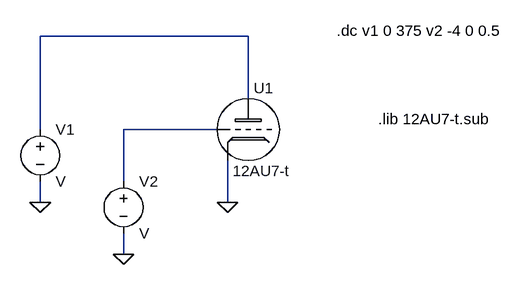
[diagram p0: schematic 12AU7.asc]
12AU7.asc, the LTspice schematic file:
Version 4
SHEET 1 880 680
WIRE 336 144 16 144
WIRE 336 240 336 144
WIRE 16 288 16 144
WIRE 288 288 144 288
WIRE 144 368 144 288
WIRE 16 400 16 368
WIRE 304 400 304 336
WIRE 144 480 144 448
FLAG 16 400 0
FLAG 144 480 0
FLAG 304 400 0
SYMBOL 12AU7-t 336 288 R0
SYMATTR InstName U1
SYMBOL voltage 16 272 R0
SYMATTR InstName V1
SYMBOL voltage 144 352 R0
SYMATTR InstName V2
TEXT 472 136 Left 2 !.dc v1 0 375 v2 -4 0 0.5
TEXT 536 272 Left 2 !.lib 12AU7-t.sub

The netlist it stands for:
* 12AU7.asc
XU1 N001 N002 0 12AU7-t  ; pins Plate Grid Cathode
V1 N001 0 V
V2 N002 0 V
.dc v1 0 375 v2 -4 0 0.5
.lib 12AU7-t.sub
.lib 12AU7-t.sub
.backanno
.end